# EAGLE design RPM (EAGLE 7.6.0)
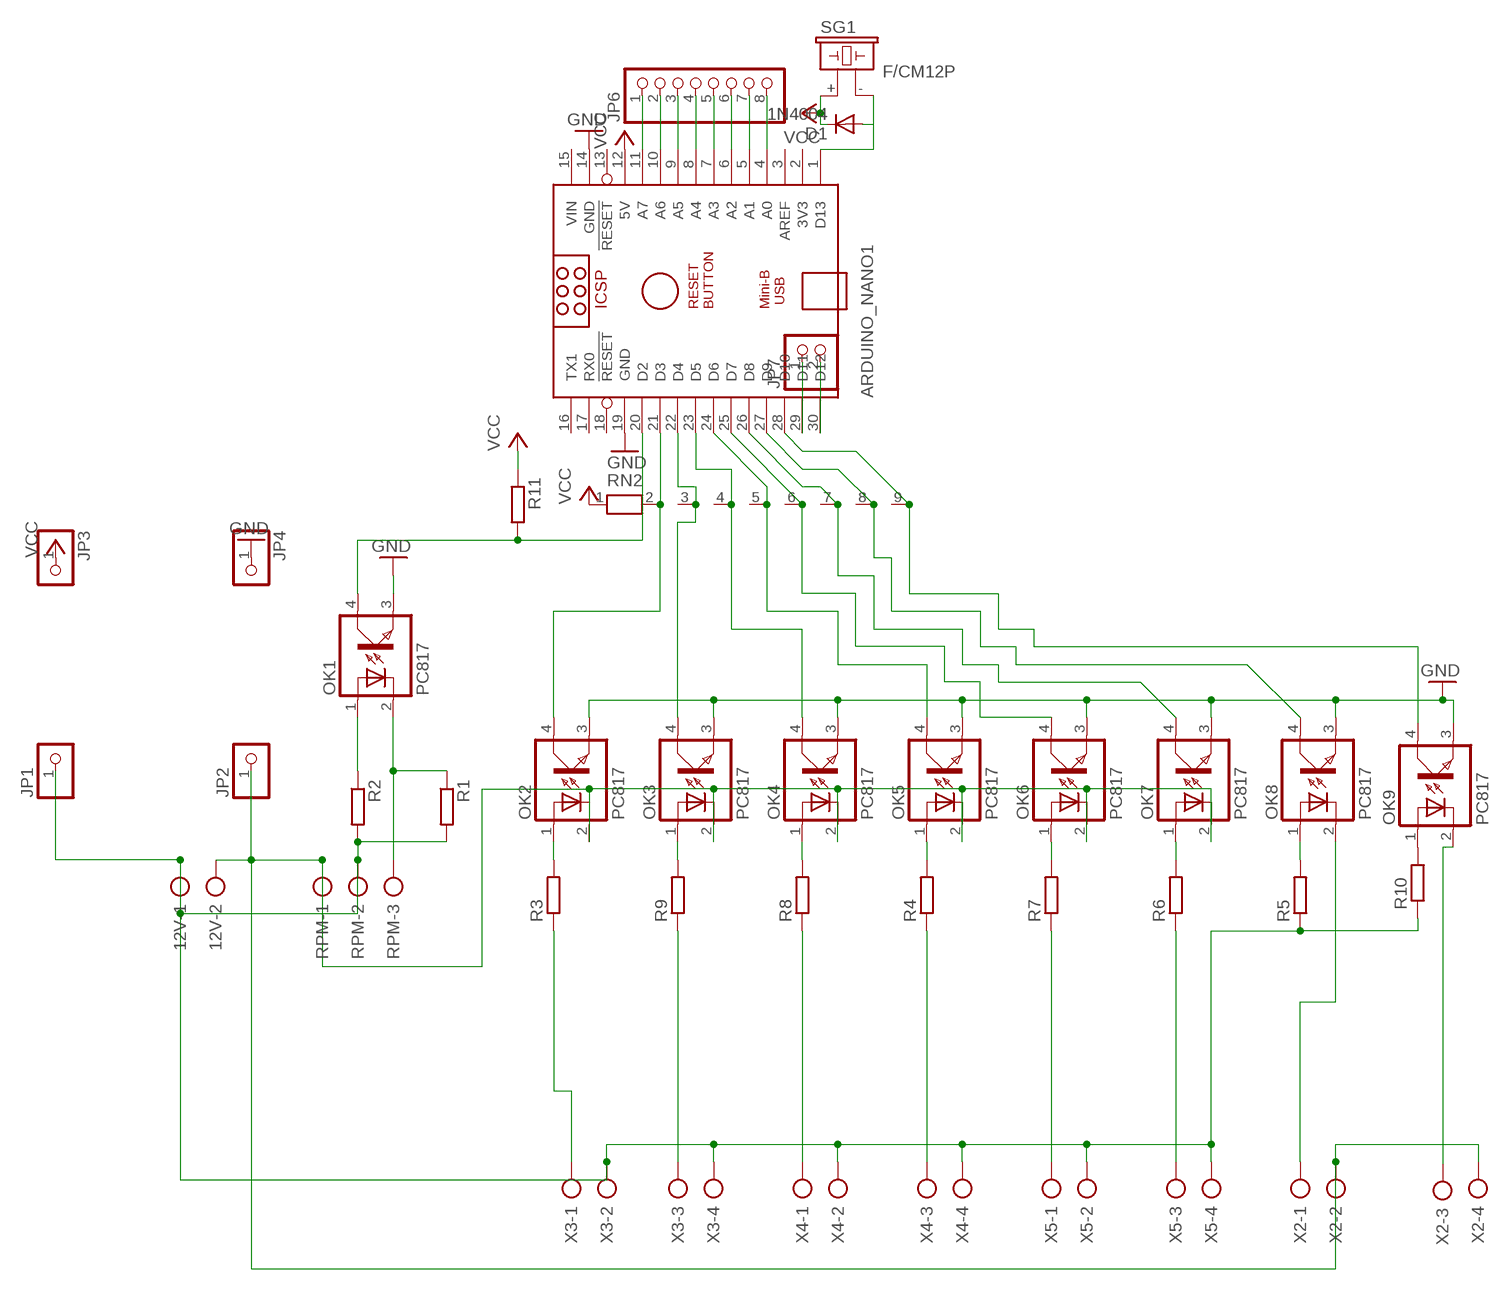
[diagram p0: schematic, sheet 1]

## Parts
12V  AK300/2  [AK300/2]
ARDUINO_NANO1  ARDUINO_NANO  [ARDUINO_NANO]
D1  1N4004  [DO41-10]
JP1  PINHD-1X1  [1X01]
JP2  PINHD-1X1  [1X01]
JP3  PINHD-1X1  [1X01]
JP4  PINHD-1X1  [1X01]
JP6  PINHD-1X8  [1X08]
JP7  PINHD-1X2  [1X02]
OK1  PC817  [DIL04]
OK2  PC817  [DIL04]
OK3  PC817  [DIL04]
OK4  PC817  [DIL04]
OK5  PC817  [DIL04]
OK6  PC817  [DIL04]
OK7  PC817  [DIL04]
OK8  PC817  [DIL04]
OK9  PC817  [DIL04]
R1  R-EU_0204/7  [0204/7]
R2  R-EU_0204/7  [0204/7]
R3  R-EU_0204/7  [0204/7]
R4  R-EU_0204/7  [0204/7]
R5  R-EU_0204/7  [0204/7]
R6  R-EU_0204/7  [0204/7]
R7  R-EU_0204/7  [0204/7]
R8  R-EU_0204/7  [0204/7]
R9  R-EU_0204/7  [0204/7]
R10  R-EU_0204/7  [0204/7]
R11  R-EU_0204/7  [0204/7]
RN2  RN08  [RN-9]
RPM  AK300/3  [AK300/3]
SG1  F/CM12P  [F/CM12P]
X2  AK300/4  [AK300/4]
X3  AK300/4  [AK300/4]
X4  AK300/4  [AK300/4]
X5  AK300/4  [AK300/4]

## Nets
12V: 12V.1 JP1.1 R1.2 R2.2 R5.1 R10.1 RPM.2 X3.2 X3.4 X4.2 X4.4 X5.2 X5.4
GND: ARDUINO_NANO1.14(GND) ARDUINO_NANO1.19(GND) JP4.1 OK1.3(EMIT) OK2.3(EMIT) OK3.3(EMIT) OK4.3(EMIT) OK5.3(EMIT) OK6.3(EMIT) OK7.3(EMIT) OK8.3(EMIT) OK9.3(EMIT)
GND12V: 12V.2 JP2.1 OK2.2(C) OK3.2(C) OK4.2(C) OK5.2(C) OK6.2(C) OK7.2(C) RPM.1 X2.2 X2.4
N$1: ARDUINO_NANO1.20(D2) OK1.4(COL) R11.2
N$2: OK1.1(A) R2.1
N$3: ARDUINO_NANO1.23(D5) OK4.4(COL) RN2.4
N$4: ARDUINO_NANO1.26(D8) OK7.4(COL) RN2.7
N$5: OK2.1(A) R3.2
N$6: OK3.1(A) R9.2
N$7: OK4.1(A) R8.2
N$8: OK5.1(A) R4.2
N$9: OK6.1(A) R7.2
N$10: OK7.1(A) R6.2
N$11: R7.1 X5.1
N$12: ARDUINO_NANO1.29(D11) JP7.1
N$13: R4.1 X4.3
N$14: OK8.2(C) X2.1
N$15: R3.1 X3.1
N$16: R9.1 X3.3
N$17: ARDUINO_NANO1.30(D12) JP7.2
N$18: ARDUINO_NANO1.11(A7) JP6.1
N$19: ARDUINO_NANO1.27(D9) OK8.4(COL) RN2.8
N$20: ARDUINO_NANO1.28(D10) OK9.4(COL) RN2.9
N$21: R8.1 X4.1
N$22: ARDUINO_NANO1.10(A6) JP6.2
N$23: ARDUINO_NANO1.21(D3) OK2.4(COL) RN2.2
N$24: ARDUINO_NANO1.22(D4) OK3.4(COL) RN2.3
N$25: OK9.2(C) X2.3
N$26: OK8.1(A) R5.2
N$27: ARDUINO_NANO1.25(D7) OK6.4(COL) RN2.6
N$29: ARDUINO_NANO1.9(A5) JP6.3
N$31: ARDUINO_NANO1.1(D13) D1.A SG1.-
N$32: ARDUINO_NANO1.8(A4) JP6.4
N$33: ARDUINO_NANO1.7(A3) JP6.5
N$34: ARDUINO_NANO1.6(A2) JP6.6
N$35: ARDUINO_NANO1.5(A1) JP6.7
N$36: ARDUINO_NANO1.4(A0) JP6.8
N$37: ARDUINO_NANO1.24(D6) OK5.4(COL) RN2.5
N$39: OK9.1(A) R10.2
N$40: R6.1 X5.3
SIGNAL: OK1.2(C) R1.1 RPM.3
VCC: ARDUINO_NANO1.12(5V) D1.C JP3.1 R11.1 RN2.1 SG1.+
Unconnected: ARDUINO_NANO1.2(3V3) ARDUINO_NANO1.3(AREF) ARDUINO_NANO1.13(!RESET) ARDUINO_NANO1.16(TX1) ARDUINO_NANO1.17(RX0) ARDUINO_NANO1.18(!RESET)

## Power pins joined to a net without a drawn wire
VIN: ARDUINO_NANO1.15(VIN)

## Library data of the parts
12V = con-ptr500:AK300/2: CONNECTOR; OC_FARNELL: unknown; OC_NEWARK: unknown
ARDUINO_NANO1 = ArduinoNanoV30:ARDUINO_NANO: Arduino Nano V3.0 Overview: The Arduino Nano is a small, complete, and breadboard-friendly board based on the ATmega328 (Arduino Nano 3.x) or ATmega168 (Arduino Nano 2.x). It has more or less the same functionality of the Arduino Duemilanove, but in a different package. It lacks only a DC power jack, and works with a Mini-B USB cable instead of a standard one. The Nano was designed and is being produced by Gravitech. Specifications: Microcontroller Atmel ATmega168 or ATmega328 Operating Voltage (logic level) 5 V Input Voltage (recommended) 7-12 V Input Voltage (limits) 6-20 V Digital I/O Pins 14 (of which 6 provide PWM output) Analog Input Pins 8 DC Current per I/O Pin 40 mA Flash Memory 16 KB (ATmega168) or 32 KB (ATmega328) of which 2 KB used by bootloader SRAM 1 KB (ATmega168) or 2 KB (ATmega328) EEPROM 512 bytes (ATmega168) or 1 KB (ATmega328) Clock Speed 16 MHz Dimensions 0.73" x 1.70" Length 45 mm Width 18 mm Weigth 5 g Power: The Arduino Nano can be powered via the Mini-B USB connection, 6-20V unregulated external power supply (pin 30), or 5V regulated external power supply (pin 27). The power source is automatically selected to the highest voltage source. Memory: The ATmega168 has 16 KB of flash memory for storing code (of which 2 KB is used for the bootloader); the ATmega328 has 32 KB, (also with 2 KB used for the bootloader). The ATmega168 has 1 KB of SRAM and 512 bytes of EEPROM (which can be read and written with the EEPROM library); the ATmega328 has 2 KB of SRAM and 1 KB of EEPROM. Input and Output: Each of the 14 digital pins on the Nano can be used as an input or output, using pinMode(), digitalWrite(), and digitalRead() functions. They operate at 5 volts. Each pin can provide or receive a maximum of 40 mA and has an internal pull-up resistor (disconnected by default) of 20-50 kOhms. In addition, some pins have specialized functions. Visit Arduino - ArduinoBoardNano <https://www.arduino.cc/en/Main/ArduinoBoardNano>
D1 = diode:1N4004: DIODE general purpose rectifier, 1 A
JP1-JP4 = pinhead:PINHD-1X1: PIN HEADER
JP6 = pinhead:PINHD-1X8: PIN HEADER
JP7 = pinhead:PINHD-1X2: PIN HEADER
OK1-OK9 = optocoupler:PC817: SHARP OPTO COUPLER; MPN: PC817X4J000F; OC_FARNELL: 9707727; OC_NEWARK: 97K7059
R1 R5 R10 R11 = rcl:R-EU_: RESISTOR, European symbol
R2-R4 R6-R9 = resistor:R-EU_: RESISTOR, European symbol
RN2 = resistor-net:RN08: RESISTOR NETWORK; OC_FARNELL: unknown; OC_NEWARK: unknown
RPM = con-ptr500:AK300/3: CONNECTOR; OC_FARNELL: unknown; OC_NEWARK: unknown
SG1 = buzzer:F/CM12P: BUZZER Source: Buerklin; OC_FARNELL: unknown; OC_NEWARK: unknown
X2-X5 = con-ptr500:AK300/4: CONNECTOR; OC_FARNELL: unknown; OC_NEWARK: unknown

## Board
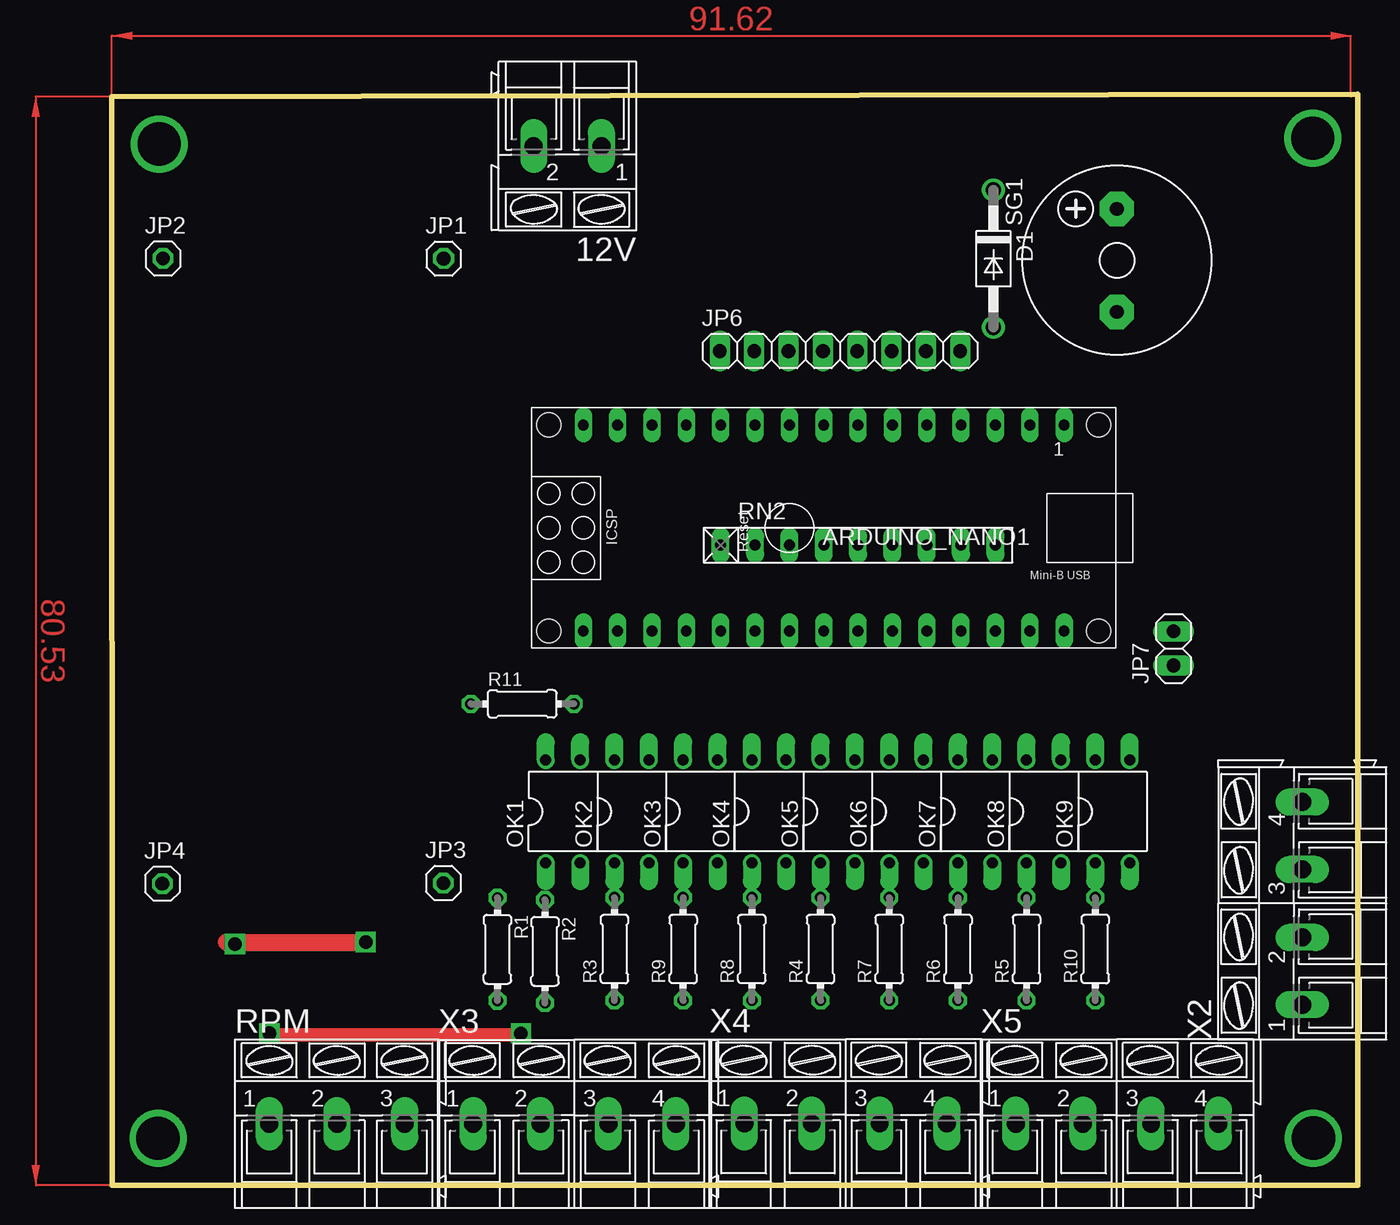
[diagram p1: board, top side]
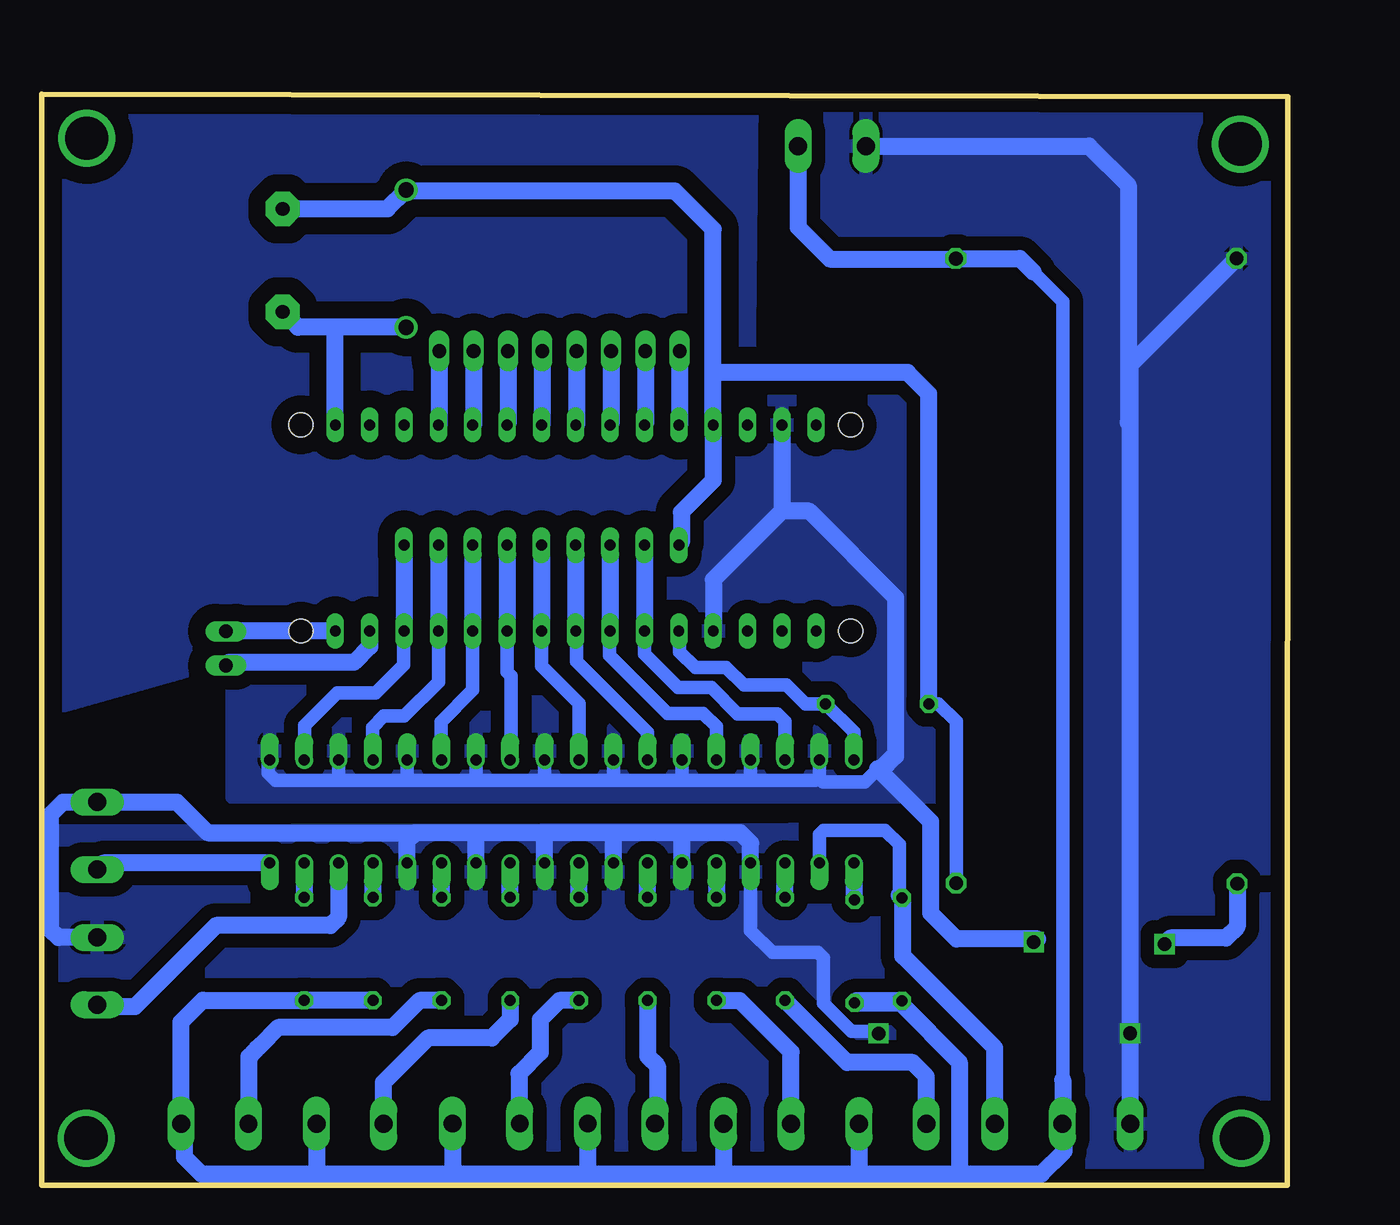
[diagram p2: board, bottom side, seen from below]

Size 92.13 x 80.69 mm. Coordinates in mm from the lower left corner, seen from the top.
Outline: 0,80.52 92.13,80.69 92.13,0 0.03,0 0.01,80.53
Copper layers (1*16): Top 0.035mm / dielectric 1.5mm / Bottom 0.035mm
Design rules "default": minimum track width 10mil, minimum drill 24mil, track to track 8mil, track to pad 8mil, pad to pad 8mil, via to via 8mil, smd to smd 8mil, copper to edge 40mil, drill to drill 8mil, minimum pad ring 10mil, minimum via ring 8mil, stop-mask expansion 4mil, vias tented up to drill 0mil, thermal gap 10mil

### Footprints (pad centres in the part's own frame; a part is rotated, then mirrored left to right if it is on the bottom)
AK300/2 = drill 1.321 long: 1 -2.515,0; 2 2.489,0
ARDUINO_NANO = drill 0.8 long: 1 -20.32,-7.62; 2 -17.78,-7.62; 3 -15.24,-7.62; 4 -12.7,-7.62; 5 -10.16,-7.62; 6 -7.62,-7.62; 7 -5.08,-7.62; 8 -2.54,-7.62; 9 0,-7.62; 10 2.54,-7.62; 11 5.08,-7.62; 12 7.62,-7.62; 13 10.16,-7.62; 14 12.7,-7.62; 15 15.24,-7.62; 16 15.24,7.62; 17 12.7,7.62; 18 10.16,7.62; 19 7.62,7.62; 20 5.08,7.62; 21 2.54,7.62; 22 0,7.62; 23 -2.54,7.62; 24 -5.08,7.62; 25 -7.62,7.62; 26 -10.16,7.62; 27 -12.7,7.62; 28 -15.24,7.62; 29 -17.78,7.62; 30 -20.32,7.62 | hole 1.778: -22.86,-7.62; -22.86,7.62; 17.78,7.62; 17.78,-7.62
DO41-10 = drill 1.118: A 5.08,0; C -5.08,0
1X01 = drill 1.016 octagon: 1 0,0
1X08 = drill 1.016 long: 1 -8.89,0; 2 -6.35,0; 3 -3.81,0; 4 -1.27,0; 5 1.27,0; 6 3.81,0; 7 6.35,0; 8 8.89,0
1X02 = drill 1.016 long: 1 -1.27,0; 2 1.27,0
DIL04 = drill 0.813 offset: 1 -1.27,-3.81; 2 1.27,-3.81; 3 1.27,3.81; 4 -1.27,3.81
0204/7 = drill 0.813 octagon: 1 -3.81,0; 2 3.81,0
RN-9 = drill 0.813 long: 1 -10.16,0; 2 -7.62,0; 3 -5.08,0; 4 -2.54,0; 5 0,0; 6 2.54,0; 7 5.08,0; 8 7.62,0; 9 10.16,0
AK300/3 = drill 1.321 long: 1 -5.004,0; 2 0,0; 3 5.004,0
F/CM12P = drill 1.016 pad 2.54 octagon: + 3.81,0; - -3.81,0
AK300/4 = drill 1.321 long: 1 -7.493,0; 2 -2.515,0; 3 2.515,0; 4 7.493,0

### Placement (x,y rotation side)
12V  33.69,76.87 180 top
ARDUINO_NANO1  50.11,48.63 180 top
D1  65.2,68.54 270 top
JP1  24.54,68.55 0 top
JP2  3.79,68.55 0 top
JP3  24.51,22.36 0 top
JP4  3.73,22.32 0 top
JP6  53.86,61.71 0 top
JP7  78.53,39.72 90 top
OK1  33.37,27.65 0 top
OK2  38.45,27.65 0 top
OK3  43.53,27.65 0 top
OK4  48.61,27.65 0 top
OK5  53.69,27.65 0 top
OK6  58.77,27.65 0 top
OK7  63.85,27.65 0 top
OK8  68.93,27.65 0 top
OK9  74.01,27.65 0 top
R1  28.52,17.47 270 top
R2  32.04,17.31 270 top
R3  37.18,17.49 90 top
R4  52.42,17.49 90 top
R5  67.66,17.49 90 top
R6  62.58,17.49 90 top
R7  57.5,17.49 90 top
R8  47.34,17.49 90 top
R9  42.26,17.49 90 top
R10  72.74,17.49 90 top
R11  30.36,35.62 0 top
RN2  55.19,47.36 0 top
RPM  16.65,4.56 0 top
SG1  74.33,68.42 90 top
X2  88.04,20.86 90 top
X3  34.22,4.56 0 top
X4  54.28,4.58 0 top
X5  74.34,4.57 0 top

### Tracks (layer width: path | path; a pad name or v marks a point on that pad's centre or on a via)
12V
  Bottom 1.016: 16.63,7.81 16.63,65.37 18.83,67.56
  Bottom 1.27: R5.1 R10.1 72.75,13.7 80.23,13.7 81.83,12.09 X5.4 81.6,4.33 81.6,2.12 80.33,0.85 72.02,0.85 | 72.02,0.85 61.31,0.85 | 61.31,0.85 51.51,0.85 | 51.51,0.85 41.85,0.85 | 41.85,0.85 31.76,0.85 | 31.76,0.85 24.58,0.85 | 24.58,0.85 18.21,0.85 16.53,2.54 16.53,4.43 RPM.2 16.63,4.58 16.63,7.81 | X3.2 31.71,0.9 31.76,0.85 | X3.4 41.72,0.99 41.85,0.85 | X4.2 51.76,1.11 51.51,0.85 | X4.4 61.77,1.32 61.31,0.85 | X5.2 71.83,1.05 72.02,0.85 | R1.2 31.88,13.66 R2.2 28.66,13.5 24.28,9.12 24.28,1.14 24.58,0.85 | 12V.1 36.21,70.86 33.87,68.52 24.57,68.52 JP1.1 19.81,68.55 18.83,67.56
GND  (via drill 1)
  Top 1.27: v9.1,17.84 8.65,17.84 8.5,17.99 v18.78,17.99
  Bottom 1.016: OK1.3 34.64,30.29 | 34.64,30.29 34.97,29.96 39.61,29.96 | 39.61,29.96 44.77,29.96 | 44.77,29.96 49.94,29.96 | 49.94,29.96 55.01,29.96 | 55.01,29.96 60.08,29.96 | 60.08,29.96 65.33,29.96 | 65.33,29.96 70.23,29.96 | 70.23,29.96 74.84,29.96 75.39,30.51 75.39,31.34 OK9.3 | OK8.3 70.2,29.99 70.23,29.96 | OK7.3 65.12,30.17 65.33,29.96 | OK6.3 60.04,30 60.08,29.96 | OK5.3 54.96,30.01 55.01,29.96 | OK4.3 49.88,30.02 49.94,29.96 | OK3.3 44.8,29.98 44.77,29.96 | OK2.3 39.72,30.06 39.61,29.96 | 34.64,30.29 34.64,30.12 34.36,29.85 31.28,29.85 30.32,30.81 29.24,31.88
  Bottom 1.27: JP4.1 3.73,19.12 4.56,18.29 8.65,18.29 v9.1,17.84 | v18.78,17.99 18.7,17.99 18.48,18.22 24.48,18.22 26.4,20.14 26.4,26.9 30.12,30.62 | 30.12,30.62 30.32,30.81 | ARDUINO_NANO1.14 37.41,49.86 | ARDUINO_NANO1.19 42.47,41.02 42.47,44.8 37.41,49.86 | 30.12,30.62 28.99,31.75 28.99,43.47 35.38,49.86 37.41,49.86
  pour Bottom (isolate 1.016): 24.34,28.72 24.34,64.16 60.09,64.16 60.09,75.32 78.06,75.32 78.06,28.68
GND12V  (via drill 1)
  Top 1.016: v30.26,11.25 30.26,11.15 30.25,11.13 11.77,11.13 v11.65,11.25
  Bottom 1.016: OK2.2 39.72,18.84 38.12,17.24 34.76,17.24 34.34,16.82 34.34,13.48 32.26,11.4 30.41,11.4 v30.26,11.25
  Bottom 1.27: OK2.2 39.72,25.32 40.48,26.09 45.12,26.09 | 45.12,26.09 50.25,26.09 | 50.25,26.09 54.9,26.09 | 54.9,26.09 59.99,26.09 | 59.99,26.09 64.36,26.09 | 64.36,26.09 64.55,26.09 65.15,25.49 65.15,23.87 OK7.2 | OK6.2 60.04,26.03 59.99,26.09 | OK5.2 54.96,26.02 54.9,26.09 | OK4.2 49.88,25.71 50.25,26.09 | OK3.2 44.8,25.76 45.12,26.09 | 64.36,26.09 64.37,26.07 79.87,26.07 82.15,28.35 X2.4 90.56,28.36 91.46,27.46 91.46,18.9 90.9,18.34 X2.2 | RPM.1 11.65,11.2 v11.65,11.25 11.65,56.3 | 11.65,56.3 11.65,60.69 JP2.1 | 12V.2 14.7,76.87 11.79,73.96 11.79,56.44 11.65,56.3
  pour Bottom (isolate 1.016): 92.07,26.21 92.07,0.04 0.13,0.04 0.13,26.39
  pour Bottom (isolate 1.016): 0.5,80.06 39.55,80.06 39.55,64.19 20.26,64.19 20.26,25.52 0.49,25.52 0.49,80.09
N$1
  Bottom 1.016: OK1.4 32.1,33.55 R11.2 35.68,35.62 37.07,37.01 40.22,37.01 41.53,38.31 43.81,38.31 44.96,39.47 44.96,40.94 ARDUINO_NANO1.20
N$2
  Bottom 1.27: R2.1 32.04,23.78 OK1.1
N$3
  Bottom 1.016: OK4.4 47.34,33.52 52.59,38.77 52.59,40.94 ARDUINO_NANO1.23
  Bottom 1.27: RN2.4 ARDUINO_NANO1.23
N$4
  Bottom 1.016: ARDUINO_NANO1.26 60.27,36.63 62.62,34.27 62.62,31.51 OK7.4
  Bottom 1.27: RN2.7 ARDUINO_NANO1.26
N$5
  Bottom 1.27: R3.2 OK2.1
N$6
  Bottom 1.27: OK3.1 R9.2
N$7
  Bottom 1.27: R8.2 OK4.1
N$8
  Bottom 1.27: R4.2 OK5.1
N$9
  Bottom 1.27: R7.2 OK6.1
N$10
  Bottom 1.27: R6.2 OK7.1
N$11
  Bottom 1.27: R7.1 57.5,12.29 58.87,10.91 63.57,10.91 66.89,7.59 66.89,4.61 X5.1
N$12
  Bottom 1.27: ARDUINO_NANO1.29 67.89,39.85 69.05,38.69 78.28,38.69 JP7.1
N$13
  Bottom 1.27: R4.1 53.86,13.68 55.28,12.25 55.28,9.84 56.86,8.26 56.86,4.64 X4.3
N$14
  Bottom 1.27: OK8.2 70.2,19.83 70.81,19.22 79.26,19.22 85.26,13.22 87.89,13.22 X2.1
N$15
  Bottom 1.27: X3.1 26.73,8.07 27.75,9.09 32.59,9.09 R3.1
N$16
  Bottom 1.27: R9.1 40.54,13.68 36.74,9.87 X3.3
N$17
  Bottom 1.27: ARDUINO_NANO1.30 78.51,41.01 JP7.2
N$18
  Bottom 1.27: JP6.1 44.97,56.31 ARDUINO_NANO1.11
N$19
  Bottom 1.016: ARDUINO_NANO1.27 62.81,37.23 65.33,34.71 66.85,34.71 67.68,33.87 67.68,31.49 OK8.4
  Bottom 1.27: RN2.8 ARDUINO_NANO1.27
N$20
  Bottom 1.016: OK9.4 72.72,31.47 72.72,34.02 70.32,36.43 67.46,36.43 65.39,38.49 65.39,40.96 ARDUINO_NANO1.28
  Bottom 1.27: RN2.9 ARDUINO_NANO1.28
N$21
  Bottom 1.27: R8.1 47.34,9.55 46.62,8.84 46.62,4.75 X4.1
N$22
  Bottom 1.27: JP6.2 47.51,56.31 ARDUINO_NANO1.10
N$23
  Bottom 1.016: OK2.4 37.18,34.33 37.73,34.88 40.68,34.88 42.62,36.83 45.08,36.83 47.57,39.32 ARDUINO_NANO1.21
  Bottom 1.27: RN2.2 ARDUINO_NANO1.21
N$24
  Bottom 1.016: OK3.4 42.26,33.94 43.23,34.91 45.87,34.91 50.16,39.19 50.16,40.96 ARDUINO_NANO1.22
  Bottom 1.27: RN2.3 ARDUINO_NANO1.22
N$25
  Bottom 1.27: OK9.2 87.58,23.84 X2.3
N$26
  Bottom 1.27: R5.2 OK8.1
N$27
  Bottom 1.016: ARDUINO_NANO1.25 57.73,37.96 57.45,37.67 57.45,31.51 OK6.4
  Bottom 1.27: RN2.6 ARDUINO_NANO1.25
N$28  (via drill 3.2 pad 3.81)
  other vias: 3.51,77.02
N$29
  Bottom 1.27: JP6.3 50.05,56.31 ARDUINO_NANO1.9
N$30  (via drill 3.2 pad 3.81)
  other vias: 3.42,3.48
N$31
  Bottom 1.27: D1.A 70.19,63.46 | 70.19,63.46 73.18,63.46 SG1.- | ARDUINO_NANO1.1 70.43,63.22 70.19,63.46
N$32
  Bottom 1.27: JP6.4 52.59,56.31 ARDUINO_NANO1.8
N$33
  Bottom 1.27: JP6.5 55.13,56.31 ARDUINO_NANO1.7
N$34
  Bottom 1.27: JP6.6 57.67,56.31 ARDUINO_NANO1.6
N$35
  Bottom 1.27: JP6.7 60.21,56.31 ARDUINO_NANO1.5
N$36
  Bottom 1.27: JP6.8 62.75,56.31 ARDUINO_NANO1.4
N$37
  Bottom 1.016: ARDUINO_NANO1.24 55.19,38.41 52.41,35.63 52.41,31.46 OK5.4
  Bottom 1.27: RN2.5 ARDUINO_NANO1.24
N$38  (via drill 3.2 pad 3.81)
  other vias: 88.87,3.5
N$39
  Bottom 1.27: OK9.1 R10.2
N$40
  Bottom 1.27: R6.1 64.2,13.68 66.2,11.68 74.65,11.68 76,10.33 76.35,9.98 76.81,9.52 76.81,4.61 X5.3
N$41  (via drill 3.2 pad 3.81)
  other vias: 88.81,77.45
N$42
  pour Bottom (isolate 1.27): 92.38,80.18 91.81,34.81 39.64,49.53 39.34,80.29
SIGNAL
  Bottom 1.016: OK1.2 34.64,25.97 34.34,26.27 29.77,26.27 28.72,25.22 28.72,21.48
  Bottom 1.27: 28.72,21.48 R1.1 28.46,21.21 28.46,16.97 21.66,10.17 RPM.3
VCC
  Bottom 1.016: JP3.1 24.51,34.31 25.82,35.62 R11.1
  Bottom 1.27: SG1.+ 66.59,72.23 D1.C 65.12,73.55 45.33,73.55 42.49,70.71 42.49,59.79 | 42.49,59.79 ARDUINO_NANO1.12 42.49,52.13 44.84,49.79 44.84,47.55 RN2.1 | 42.49,59.79 42.16,60.12 28.12,60.12 26.55,58.54 R11.1
(copper drawn outside any net)
  shapes: Top area x2